# EAGLE design supercontroller (EAGLE 9.6.2)
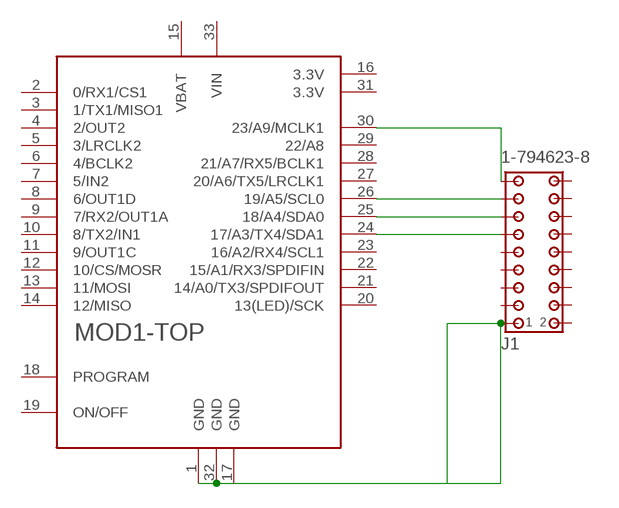
[diagram p0: schematic, sheet 1]

## Parts
J1  1-794623-8  [1-794623-8]
MOD1  TEENSY4.0+POGOSEP  [TEENSY4.0+POGO]

## Nets
N$1: J1.1 MOD1.1(-TOP:GND) MOD1.17(-TOP:GND) MOD1.32(-TOP:GND)
N$3: J1.17 MOD1.30(-TOP:23/A9/MCLK1)
N$4: J1.15 MOD1.26(-TOP:19/A5/SCL0)
N$5: J1.13 MOD1.25(-TOP:18/A4/SDA0)
N$6: J1.11 MOD1.24(-TOP:17/A3/TX4/SDA1)
Unconnected: J1.2 J1.3 J1.4 J1.5 J1.6 J1.7 J1.8 J1.9 J1.10 J1.12 J1.14 J1.16 J1.18 MOD1.2(-TOP:0/RX1/CS1) MOD1.3(-TOP:1/TX1/MISO1) MOD1.4(-TOP:2/OUT2) MOD1.5(-TOP:3/LRCLK2) MOD1.6(-TOP:4/BCLK2) MOD1.7(-TOP:5/IN2) MOD1.8(-TOP:6/OUT1D) MOD1.9(-TOP:7/RX2/OUT1A) MOD1.10(-TOP:8/TX2/IN1) MOD1.11(-TOP:9/OUT1C) MOD1.12(-TOP:10/CS/MOSR) MOD1.13(-TOP:11/MOSI) MOD1.14(-TOP:12/MISO) MOD1.16(-TOP:3.3V) MOD1.18(-TOP:PROGRAM) MOD1.19(-TOP:ON/OFF) MOD1.20(-TOP:13(LED)/SCK) MOD1.21(-TOP:14/A0/TX3/SPDIFOUT) MOD1.22(-TOP:15/A1/RX3/SPDIFIN) MOD1.23(-TOP:16/A2/RX4/SCL1) MOD1.27(-TOP:20/A6/TX5/LRCLK1) MOD1.28(-TOP:21/A7/RX5/BCLK1) MOD1.29(-TOP:22/A8) MOD1.31(-TOP:3.3V) MOD1.34(-BACK:32/OUT1B) MOD1.35(-BACK:33/MCLK2) MOD1.36 MOD1.37 MOD1.38(-BACK:28/RX7) MOD1.39(-BACK:29/TX7) MOD1.40(-BACK:26/A12/MOSI1) MOD1.41(-BACK:27/A13/SCK1) MOD1.42(-BACK:24/A10/TX6/SCL2) MOD1.43(-BACK:25/A11/RX6/SDA2) MOD1.44(-BACK:VUSB)

## Power pins joined to a net without a drawn wire
VBAT: MOD1.15(-TOP:VBAT)
VIN: MOD1.33(-TOP:VIN)

## Library data of the parts
J1 = con-amp:1-794623-8: MICRO MATE N LOK Dual Row, grid 1.5 mm Source: http://catalog.tycoelectronics.com .. ENG_CD_794623_F.pdf
MOD1 = teensy:TEENSY4.0+POGOSEP: Teensy 4.0 Module base pin connections (top side) and Pogo Pin connections to back of board Pogo pin size 0.5mm for Mill-Max 0908-9-15-20-75-14-11-0 or 0978-0-15-20-75-14-11-0

## Board
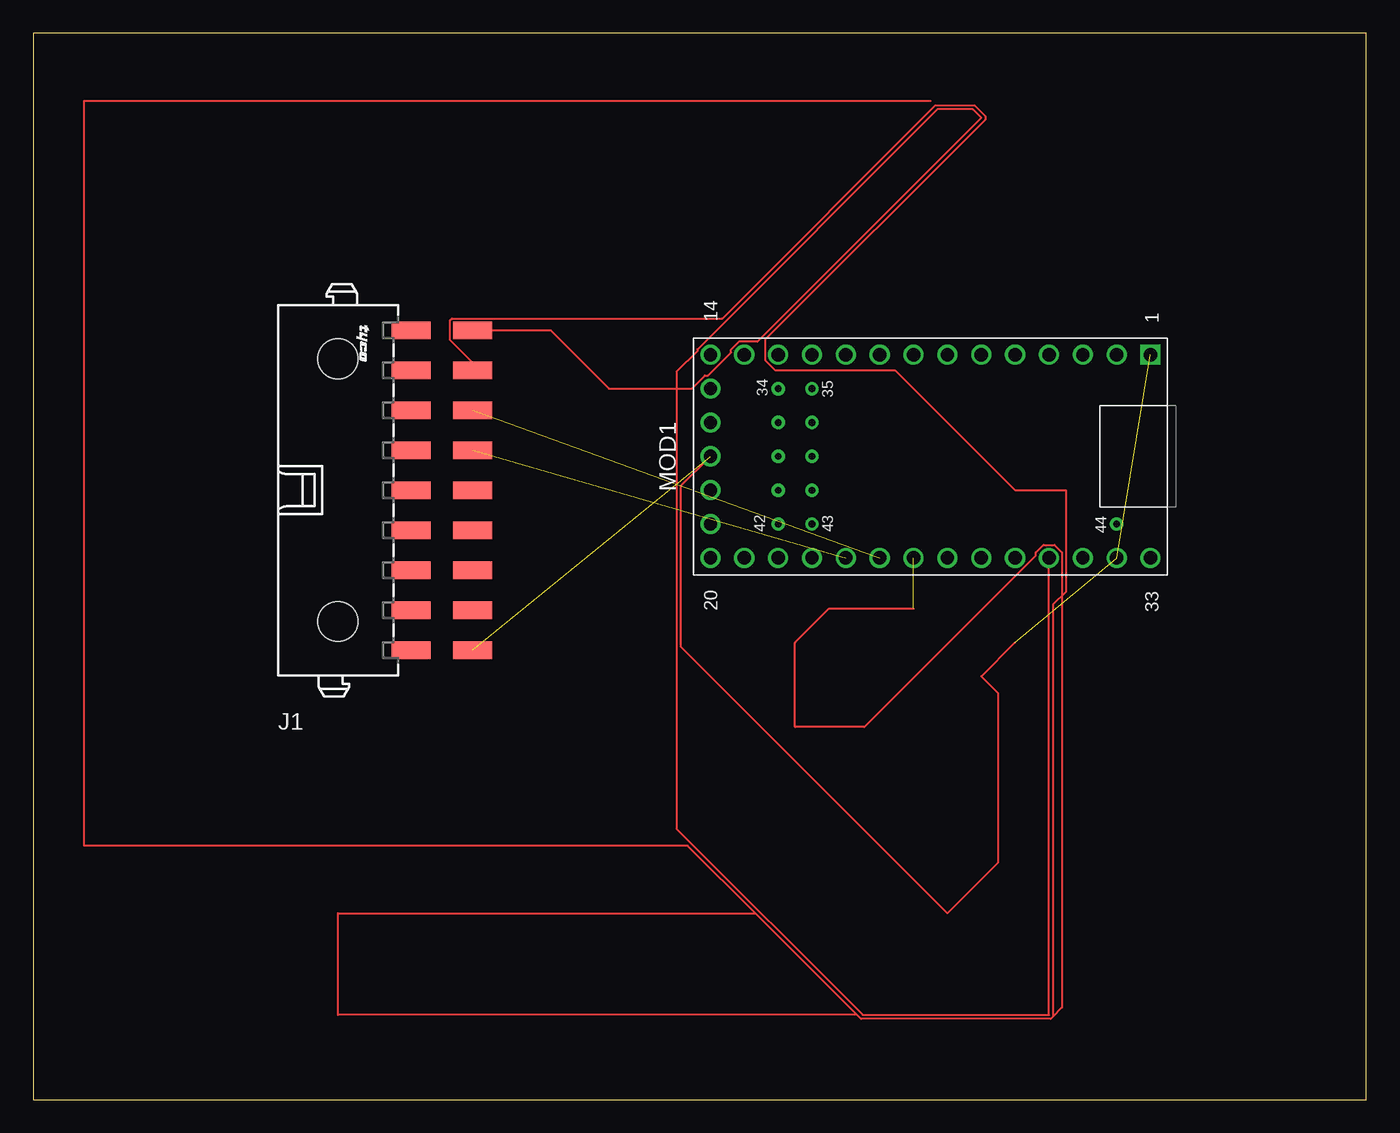
[diagram p1: board, top side]
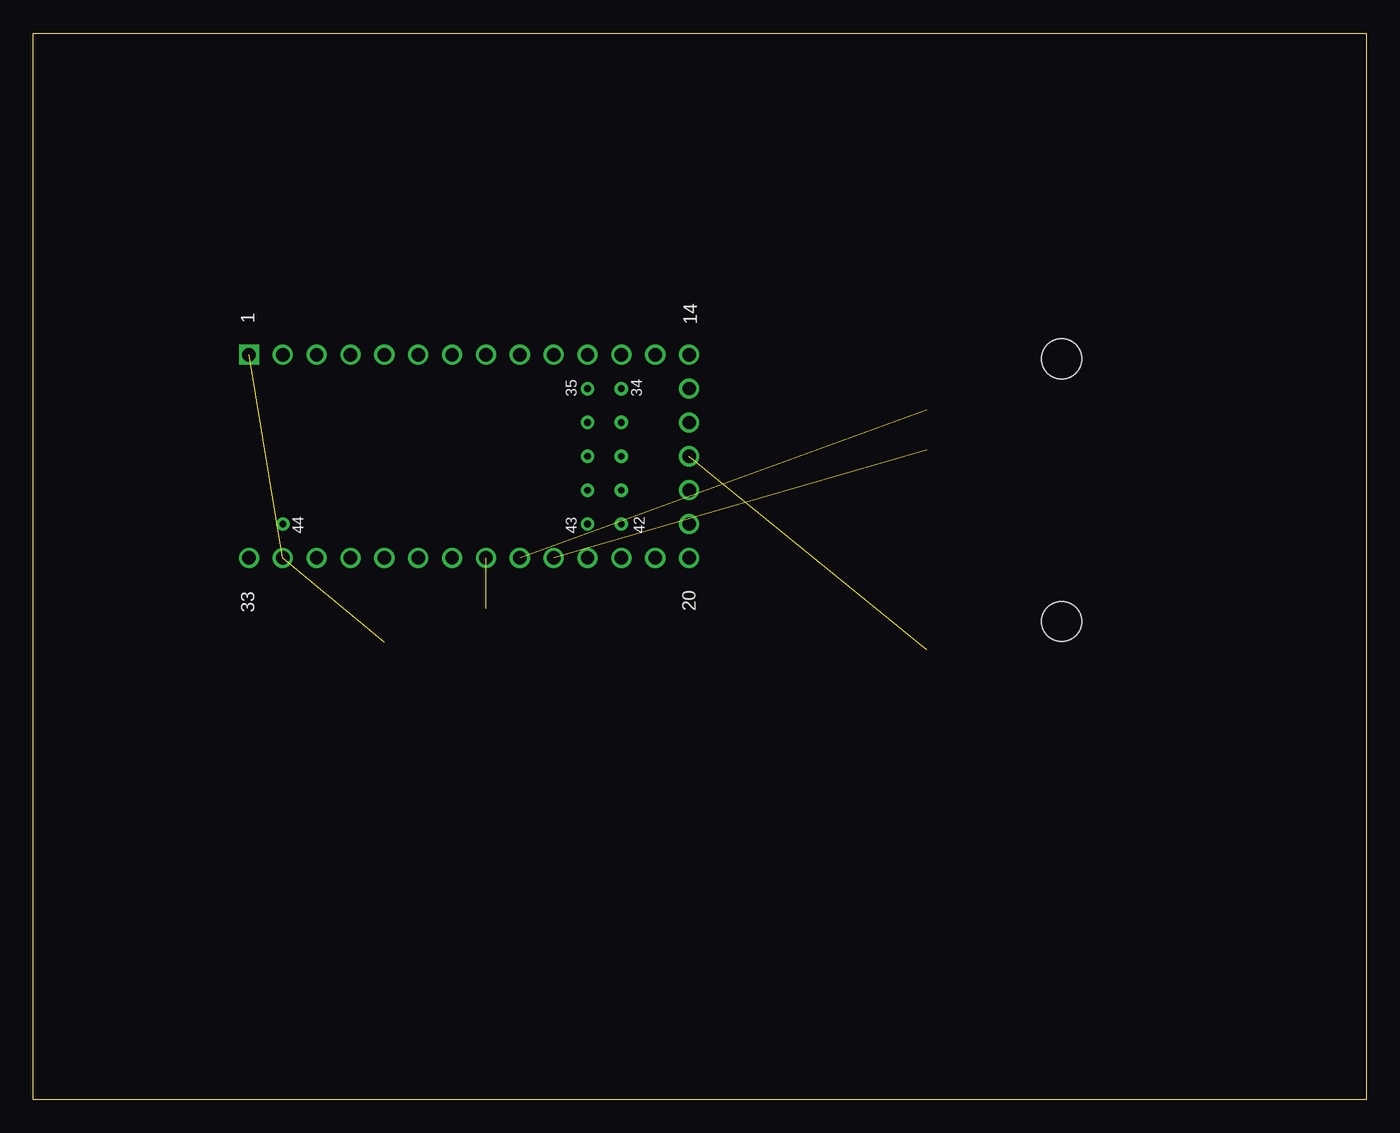
[diagram p2: board, bottom side, seen from below]

Size 100 x 80 mm. Coordinates in mm from the lower left corner, seen from the top.
Outline: 0,0 100,0 100,80 0,80 0,0
Copper layers (1*16): Top 0.035mm / dielectric 1.5mm / Bottom 0.035mm
Design rules "default": minimum track width 6mil, minimum drill 0.35mm, track to track 6mil, track to pad 6mil, pad to pad 6mil, via to via 6mil, smd to smd 6mil, copper to edge 40mil, drill to drill 6mil, minimum pad ring 10mil, minimum via ring 8mil, stop-mask expansion 4mil, vias tented up to drill 0mil, thermal gap 10mil

### Footprints (pad centres in the part's own frame; a part is rotated, then mirrored left to right if it is on the bottom)
1-794623-8 = smd 1.3 x 2.92: 1 12,10.1; 2 12,5.48; 3 9,10.1; 4 9,5.48; 5 6,10.1; 6 6,5.48; 7 3,10.1; 8 3,5.48; 9 0,10.1; 10 0,5.48; 11 -3,10.1; 12 -3,5.48; 13 -6,10.1; 14 -6,5.48; 15 -9,10.1; 16 -9,5.48; 17 -12,10.1; 18 -12,5.48 | hole 3: -9.85,0; 9.85,0
TEENSY4.0+POGO = drill 1 square: 1 -7.62,16.51 | drill 1: 2 -7.62,13.97; 3 -7.62,11.43; 4 -7.62,8.89; 5 -7.62,6.35; 6 -7.62,3.81; 7 -7.62,1.27; 8 -7.62,-1.27; 9 -7.62,-3.81; 10 -7.62,-6.35; 11 -7.62,-8.89; 12 -7.62,-11.43; 13 -7.62,-13.97; 14 -7.62,-16.51; 15 -5.08,-16.51; 16 -2.54,-16.51; 17 0,-16.51; 18 2.54,-16.51; 19 5.08,-16.51; 20 7.62,-16.51; 21 7.62,-13.97; 22 7.62,-11.43; 23 7.62,-8.89; 24 7.62,-6.35; 25 7.62,-3.81; 26 7.62,-1.27; 27 7.62,1.27; 28 7.62,3.81; 29 7.62,6.35; 30 7.62,8.89; 31 7.62,11.43; 32 7.62,13.97; 33 7.62,16.51 | drill 0.5: 34 -5.08,-11.43; 35 -5.08,-8.89; 36 -2.54,-11.43; 37 -2.54,-8.89; 38 0,-11.43; 39 0,-8.89; 40 2.54,-11.43; 41 2.54,-8.89; 42 5.08,-11.43; 43 5.08,-8.89; 44 5.08,13.97

### Placement (x,y rotation side)
J1  22.86,45.72 270 top
MOD1  67.31,48.26 270 top

### Tracks (layer width: path | path; a pad name or v marks a point on that pad's centre or on a via)
N$1  (3 unrouted)
  Top 0.152: MOD1.17 48.56,46.02 48.56,33.98 68.58,13.97 72.39,17.78 72.39,30.48 71.12,31.75 73.66,34.29
N$3
  Top 0.152: J1.17 38.8,57.72 43.18,53.34 49.41,53.34 50.39,54.32 50.63,54.32 52.36,56.05 52.36,56.29 52.93,56.86 54.32,56.86 71.12,73.66 70.48,74.3 67.83,74.3 49.82,56.29 49.82,56.17 48.26,54.61 48.26,20.32 62.23,6.35 76.2,6.35 MOD1.30
N$4  (1 unrouted)
  Top 0.152: J1.15 32.96,55.29 31.27,56.98 31.27,58.47 31.41,58.6 51.7,58.6 67.7,74.6 70.61,74.6 71.42,73.79 71.42,73.53 54.9,57.01 54.9,55.47 55.65,54.72 64.66,54.72 73.66,45.72 77.47,45.72 77.47,38.1 76.5,37.13 76.5,6.22 | 61.8,6.35 62.1,6.04 76.33,6.04 76.5,6.22 | 61.8,6.35 22.86,6.35 22.86,13.97 54.18,13.97 | 54.18,13.97 61.8,6.35 | 54.18,13.97 49.1,19.05 3.81,19.05 3.81,74.93 67.31,74.93 | 76.5,6.22 77.18,6.9 77.18,41.05 76.61,41.62 75.79,41.62 75.22,41.05 75.22,40.81 62.35,27.94 57.15,27.94 57.15,34.29 59.69,36.83 66.04,36.83
N$5  (1 unrouted)
N$6  (1 unrouted)